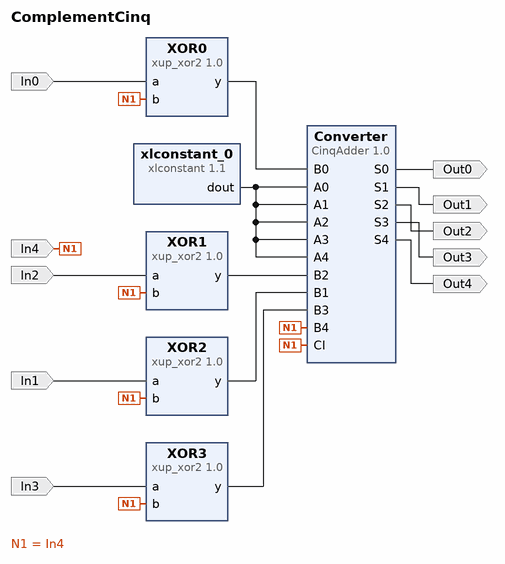
[diagram p0: block diagram of the top level]
# Vivado block design ComplementCinq, xc7a35tcpg236-1, Vivado 2017.2
create_bd_design ComplementCinq

create_bd_port -dir I In0
create_bd_port -dir I In1
create_bd_port -dir I In2
create_bd_port -dir I In3
create_bd_port -dir I In4
create_bd_port -dir O Out0
create_bd_port -dir O Out1
create_bd_port -dir O Out2
create_bd_port -dir O Out3
create_bd_port -dir O Out4

create_bd_cell -type ip -vlnv xilinx.com:ip:xlconstant:1.1 xlconstant_0
set_property -dict {CONFIG.CONST_WIDTH 1 CONFIG.CONST_VAL 0} [get_bd_cells xlconstant_0]
create_bd_cell -type ip -vlnv xilinx.com:xup:xup_xor2:1.0 XOR0
create_bd_cell -type ip -vlnv xilinx.com:xup:xup_xor2:1.0 XOR1
create_bd_cell -type ip -vlnv xilinx.com:xup:xup_xor2:1.0 XOR2
create_bd_cell -type ip -vlnv xilinx.com:xup:xup_xor2:1.0 XOR3
create_bd_cell -type ip -vlnv xilinx.com:user:CinqAdder:1.0 Converter

# ---- connections ----

connect_bd_net -net In0_1 [get_bd_ports In0] [get_bd_pins XOR0/a]
connect_bd_net -net In1_1 [get_bd_ports In1] [get_bd_pins XOR2/a]
connect_bd_net -net In2_1 [get_bd_ports In2] [get_bd_pins XOR1/a]
connect_bd_net -net In3_1 [get_bd_ports In3] [get_bd_pins XOR3/a]
connect_bd_net -net In4_1 [get_bd_ports In4] \
  [get_bd_pins XOR0/b] [get_bd_pins XOR2/b] [get_bd_pins XOR1/b] [get_bd_pins XOR3/b] [get_bd_pins Converter/B4] \
  [get_bd_pins Converter/CI]
connect_bd_net [get_bd_pins xlconstant_0/dout] \
  [get_bd_pins Converter/A0] [get_bd_pins Converter/A1] [get_bd_pins Converter/A2] [get_bd_pins Converter/A3] \
  [get_bd_pins Converter/A4]
connect_bd_net [get_bd_pins XOR0/y] [get_bd_pins Converter/B0]
connect_bd_net [get_bd_pins XOR2/y] [get_bd_pins Converter/B1]
connect_bd_net [get_bd_pins XOR1/y] [get_bd_pins Converter/B2]
connect_bd_net [get_bd_pins XOR3/y] [get_bd_pins Converter/B3]
connect_bd_net [get_bd_pins Converter/S0] [get_bd_ports Out0]
connect_bd_net [get_bd_pins Converter/S1] [get_bd_ports Out1]
connect_bd_net [get_bd_pins Converter/S2] [get_bd_ports Out2]
connect_bd_net [get_bd_pins Converter/S3] [get_bd_ports Out3]
connect_bd_net [get_bd_pins Converter/S4] [get_bd_ports Out4]

validate_bd_design
save_bd_design
